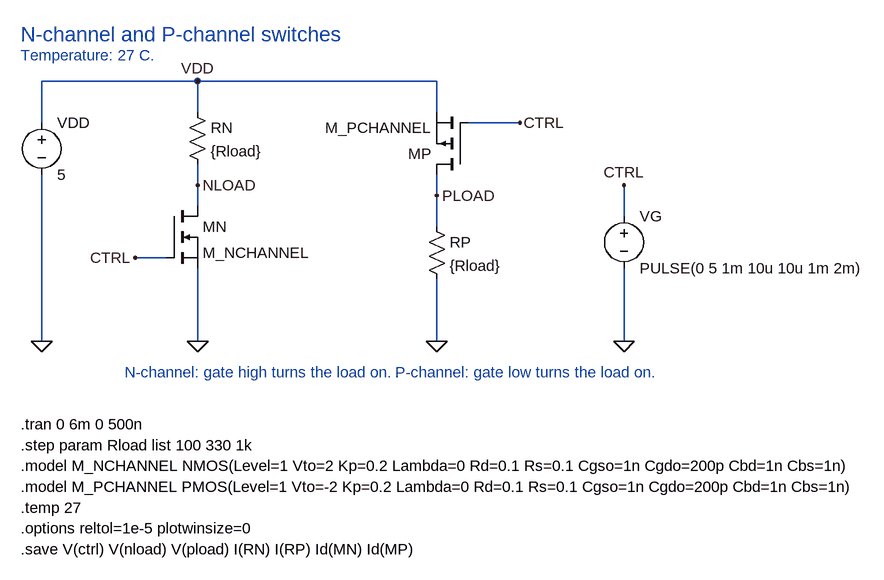
[diagram p0: schematic mosfet-switches.asc]
mosfet-switches.asc, the LTspice schematic file:
Version 4
SHEET 1 1280 1000
WIRE 80 160 80 96
WIRE 80 96 320 96
WIRE 320 96 688 96
WIRE 688 96 688 144
WIRE 320 96 320 144
WIRE 320 224 320 288
WIRE 688 240 688 320
WIRE 272 368 224 368
WIRE 736 160 816 160
WIRE 976 304 976 256
WIRE 80 240 80 496
WIRE 320 384 320 496
WIRE 688 400 688 496
WIRE 976 384 976 496
FLAG 320 96 VDD
FLAG 320 256 NLOAD
FLAG 688 272 PLOAD
FLAG 224 368 CTRL
FLAG 816 160 CTRL
FLAG 976 256 CTRL
FLAG 80 496 0
FLAG 320 496 0
FLAG 688 496 0
FLAG 976 496 0
SYMBOL voltage 80 144 R0
SYMATTR InstName VDD
SYMATTR Value 5
SYMBOL res 304 128 R0
SYMATTR InstName RN
SYMATTR Value {Rload}
SYMBOL nmos 272 288 R0
SYMATTR InstName MN
SYMATTR Value M_NCHANNEL
SYMBOL pmos 736 240 R180
SYMATTR InstName MP
SYMATTR Value M_PCHANNEL
SYMBOL res 672 304 R0
SYMATTR InstName RP
SYMATTR Value {Rload}
SYMBOL voltage 976 288 R0
SYMATTR InstName VG
SYMATTR Value PULSE(0 5 1m 10u 10u 1m 2m)
TEXT 48 24 Left 3 ;N-channel and P-channel switches
TEXT 48 56 Left 2 ;Temperature: 27 C.
TEXT 208 544 Left 2 ;N-channel: gate high turns the load on.
TEXT 624 544 Left 2 ;P-channel: gate low turns the load on.
TEXT 48 624 Left 2 !.tran 0 6m 0 500n
TEXT 48 656 Left 2 !.step param Rload list 100 330 1k
TEXT 48 688 Left 2 !.model M_NCHANNEL NMOS(Level=1 Vto=2 Kp=0.2 Lambda=0 Rd=0.1 Rs=0.1 Cgso=1n Cgdo=200p Cbd=1n Cbs=1n)
TEXT 48 720 Left 2 !.model M_PCHANNEL PMOS(Level=1 Vto=-2 Kp=0.2 Lambda=0 Rd=0.1 Rs=0.1 Cgso=1n Cgdo=200p Cbd=1n Cbs=1n)
TEXT 48 752 Left 2 !.temp 27
TEXT 48 784 Left 2 !.options reltol=1e-5 plotwinsize=0
TEXT 48 816 Left 2 !.save V(ctrl) V(nload) V(pload) I(RN) I(RP) Id(MN) Id(MP)

The netlist it stands for:
* mosfet-switches.asc
VDD VDD 0 5
RN VDD NLOAD {Rload}
MN NLOAD CTRL 0 0 M_NCHANNEL
MP PLOAD CTRL VDD VDD M_PCHANNEL
RP PLOAD 0 {Rload}
VG CTRL 0 PULSE(0 5 1m 10u 10u 1m 2m)
.model NMOS NMOS
.model PMOS PMOS
.lib standard.mos
* N-channel and P-channel switches
* Temperature: 27 C.
* N-channel: gate high turns the load on.
* P-channel: gate low turns the load on.
.tran 0 6m 0 500n
.step param Rload list 100 330 1k
.model M_NCHANNEL NMOS(Level=1 Vto=2 Kp=0.2 Lambda=0 Rd=0.1 Rs=0.1 Cgso=1n Cgdo=200p Cbd=1n Cbs=1n)
.model M_PCHANNEL PMOS(Level=1 Vto=-2 Kp=0.2 Lambda=0 Rd=0.1 Rs=0.1 Cgso=1n Cgdo=200p Cbd=1n Cbs=1n)
.temp 27
.options reltol=1e-5 plotwinsize=0
.save V(ctrl) V(nload) V(pload) I(RN) I(RP) Id(MN) Id(MP)
.backanno
.end